# EAGLE schematic frc_operator_interface (EAGLE 6.5.0)
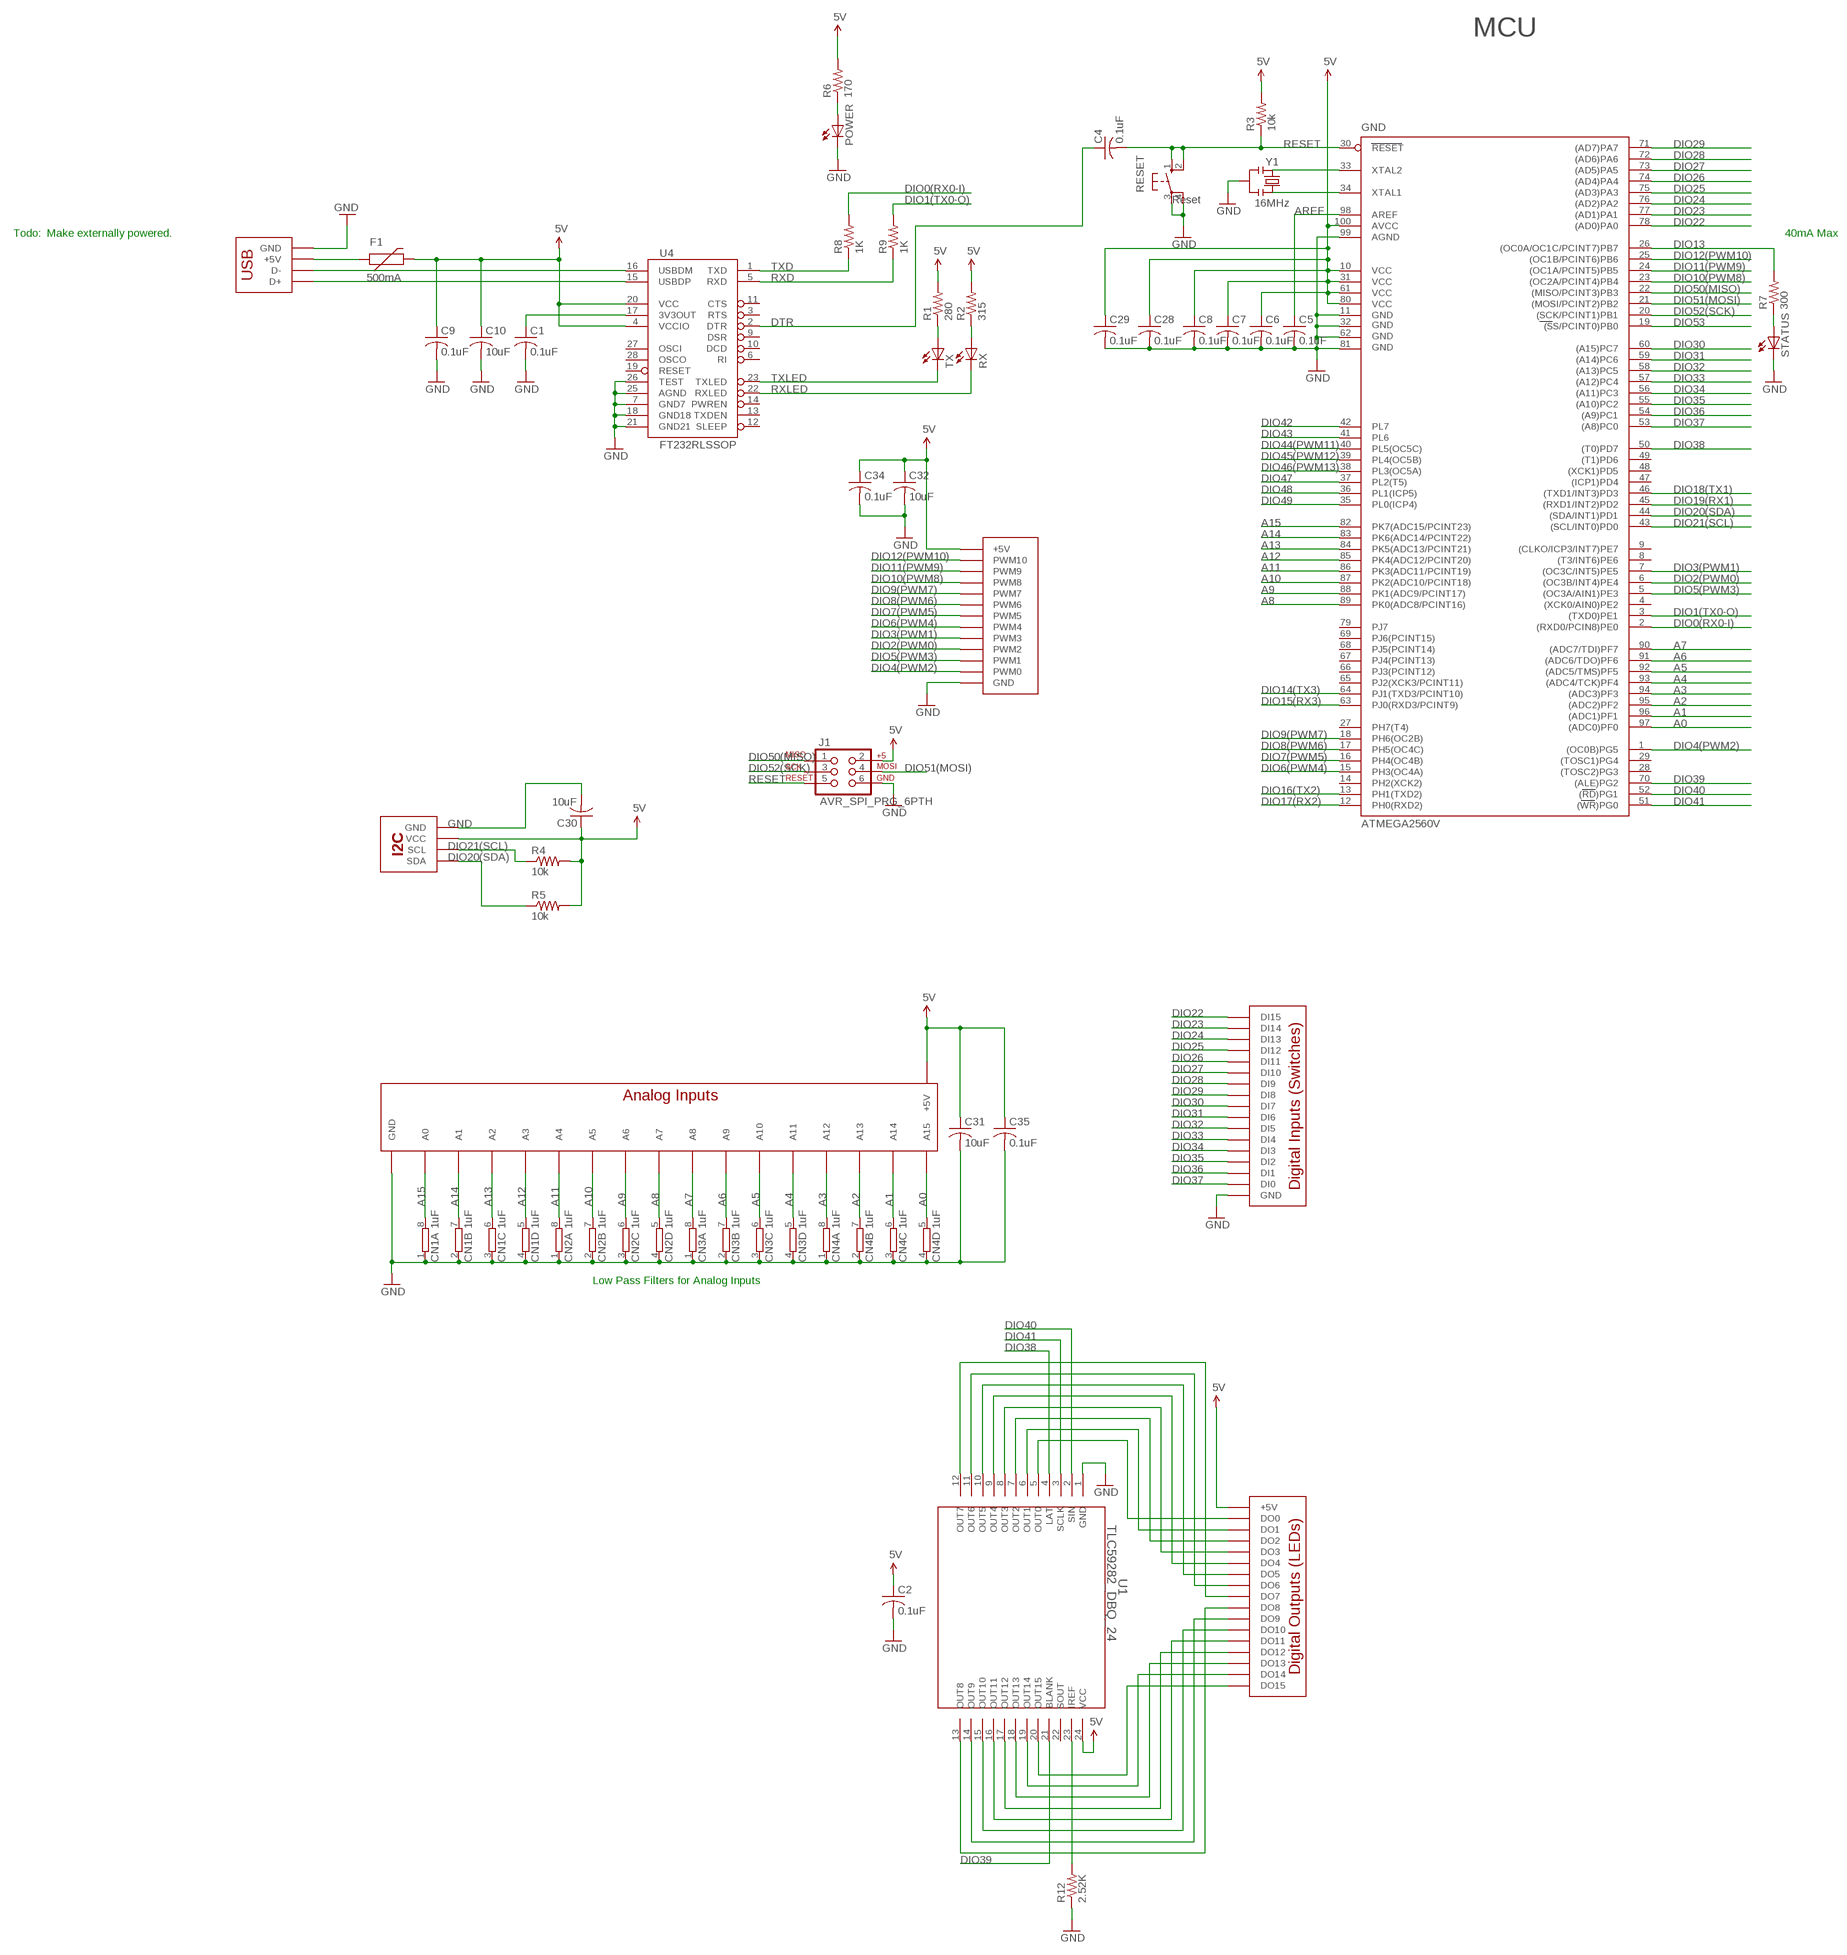
[diagram p0: schematic, sheet 1]

## Parts
C1  0.1uF  C-USC1206  [C1206]
C2  0.1uF  C-USC1206  [C1206]
C4  0.1uF  C-USC1206  [C1206]
C5  0.1uF  C-USC1206  [C1206]
C6  0.1uF  C-USC1206  [C1206]
C7  0.1uF  C-USC1206  [C1206]
C8  0.1uF  C-USC1206  [C1206]
C9  0.1uF  C-USC1206  [C1206]
C10  10uF  C-USC1206  [C1206]
C28  0.1uF  C-USC1206  [C1206]
C29  0.1uF  C-USC1206  [C1206]
C30  10uF  C-USC1206  [C1206]
C31  10uF  C-USC1206  [C1206]
C32  10uF  C-USC1206  [C1206]
C34  0.1uF  C-USC1206  [C1206]
C35  0.1uF  C-USC1206  [C1206]
CN1  1uF  4R-NEXB38V  [EXB38V]
CN2  1uF  4R-NEXB38V  [EXB38V]
CN3  1uF  4R-NEXB38V  [EXB38V]
CN4  1uF  4R-NEXB38V  [EXB38V]
F1  500mA  PTCSMD  [PTC-1206]
GND  ATMEGA2560AU  [TQFP100]
J1  AVR_SPI_PRG_6PTH  [2X3]
POWER  LED3MM  [LED3MM]
R1  280  R-US_M1206  [M1206]
R2  315  R-US_M1206  [M1206]
R3  10k  R-US_M1206  [M1206]
R4  10k  R-US_M1206  [M1206]
R5  10k  R-US_M1206  [M1206]
R6  170  R-US_M1206  [M1206]
R7  300  R-US_M1206  [M1206]
R8  1K  R-US_M1206  [M1206]
R9  1K  R-US_M1206  [M1206]
R12  2.52K  R-US_M1206  [M1206]
RESET  10-XX  [B3F-10XX]
RX  LED3MM  [LED3MM]
STATUS  LED3MM  [LED3MM]
TX  LED3MM  [LED3MM]
U1  TLC59282_DBQ_24  [DBQ24]
U4  FT232RLSSOP  [SSOP28DB]
U$2  DIGITALIN  [DIGITALIN]
U$10  PWMHEADER  [PWMHEADER]
U$11  DIGITALOUTPUTS  [DIGITALOUT]
U$12  ANALOGHEADER  [ANALOGHEADER]
U$14  UE27BC54130-USB  [UE27BC54130-USB]
U$15  I2CHEADER  [I2CHEADER]
Y1  RESONATORSMD  [RESONATOR-SMD]

## Nets
5V [power]: C2.1 C6.1 C7.1 C8.1 C9.1 C10.1 C28.1 C29.1 C30.1 C31.1 C32.1 C34.1 C35.1 F1.2 GND.10(VCC) GND.31(VCC1) GND.61(VCC2) GND.80(VCC3) GND.100(AVCC) J1.2 R1.2 R2.2 R3.2 R4.2 R5.2 R6.2 U1.24(VCC) U4.4(VCCIO) U4.20(VCC) U$10.+5V@3(+5V) U$10.+5V@4(+5V) U$10.+5V@5(+5V) U$10.+5V@6(+5V) U$10.+5V@7(+5V) U$10.+5V@8(+5V) U$10.+5V@9(+5V) U$10.+5V@10(+5V) U$10.+5V@11(+5V) U$10.+5V@12(+5V) U$10.+5V@13(+5V) U$11.+5V@0(+5V) U$11.+5V@1(+5V) U$11.+5V@2(+5V) U$11.+5V@3(+5V) U$11.+5V@4(+5V) U$11.+5V@5(+5V) U$11.+5V@6(+5V) U$11.+5V@7(+5V) U$11.+5V@8(+5V) U$11.+5V@9(+5V) U$11.+5V@10(+5V) U$11.+5V@11(+5V) U$11.+5V@12(+5V) U$11.+5V@13(+5V) U$11.+5V@14(+5V) U$11.+5V@15(+5V) U$12.+5V@0(+5V) U$12.+5V@1(+5V) U$12.+5V@2(+5V) U$12.+5V@3(+5V) U$12.+5V@4(+5V) U$12.+5V@5(+5V) U$12.+5V@6(+5V) U$12.+5V@7(+5V) U$12.+5V@8(+5V) U$12.+5V@9(+5V) U$12.+5V@10(+5V) U$12.+5V@11(+5V) U$12.+5V@12(+5V) U$12.+5V@13(+5V) U$12.+5V@14(+5V) U$12.+5V@15(+5V) U$15.VCC@0(VCC) U$15.VCC@1(VCC) U$15.VCC@2(VCC) U$15.VCC@3(VCC)
A0: CN4.5 GND.97((ADC0)PF0) U$12.15(A15)
A1: CN4.6 GND.96((ADC1)PF1) U$12.14(A14)
A2: CN4.7 GND.95((ADC2)PF2) U$12.13(A13)
A3: CN4.8 GND.94((ADC3)PF3) U$12.12(A12)
A4: CN3.5 GND.93((ADC4/TCK)PF4) U$12.11(A11)
A5: CN3.6 GND.92((ADC5/TMS)PF5) U$12.10(A10)
A6: CN3.7 GND.91((ADC6/TDO)PF6) U$12.9(A9)
A7: CN3.8 GND.90((ADC7/TDI)PF7) U$12.8(A8)
A8: CN2.5 GND.89(PK0(ADC8/PCINT16)) U$12.7(A7)
A9: CN2.6 GND.88(PK1(ADC9/PCINT17)) U$12.6(A6)
A10: CN2.7 GND.87(PK2(ADC10/PCINT18)) U$12.5(A5)
A11: CN2.8 GND.86(PK3(ADC11/PCINT19)) U$12.4(A4)
A12: CN1.5 GND.85(PK4(ADC12/PCINT20)) U$12.3(A3)
A13: CN1.6 GND.84(PK5(ADC13/PCINT21)) U$12.2(A2)
A14: CN1.7 GND.83(PK6(ADC14/PCINT22)) U$12.1(A1)
A15: CN1.8 GND.82(PK7(ADC15/PCINT23)) U$12.0(A0)
AREF: C5.1 GND.98(AREF)
DIO0(RX0-I): GND.2((RXD0/PCIN8)PE0) R8.2
DIO1(TX0-O): GND.3((TXD0)PE1) R9.2
DIO2(PWM0): GND.6((OC3B/INT4)PE4) U$10.2(PWM2)
DIO3(PWM1): GND.7((OC3C/INT5)PE5) U$10.3(PWM3)
DIO4(PWM2): GND.1((OC0B)PG5) U$10.0(PWM0)
DIO5(PWM3): GND.5((OC3A/AIN1)PE3) U$10.1(PWM1)
DIO6(PWM4): GND.15(PH3(OC4A)) U$10.4(PWM4)
DIO7(PWM5): GND.16(PH4(OC4B)) U$10.5(PWM5)
DIO8(PWM6): GND.17(PH5(OC4C)) U$10.6(PWM6)
DIO9(PWM7): GND.18(PH6(OC2B)) U$10.7(PWM7)
DIO10(PWM8): GND.23((OC2A/PCINT4)PB4) U$10.8(PWM8)
DIO11(PWM9): GND.24((OC1A/PCINT5)PB5) U$10.9(PWM9)
DIO12(PWM10): GND.25((OC1B/PCINT6)PB6) U$10.10(PWM10)
DIO13: GND.26((OC0A/OC1C/PCINT7)PB7) R7.2
DIO14(TX3): GND.64(PJ1(TXD3/PCINT10))
DIO15(RX3): GND.63(PJ0(RXD3/PCINT9))
DIO16(TX2): GND.13(PH1(TXD2))
DIO17(RX2): GND.12(PH0(RXD2))
DIO18(TX1): GND.46((TXD1/INT3)PD3)
DIO19(RX1): GND.45((RXD1/INT2)PD2)
DIO20(SDA): GND.44((SDA/INT1)PD1) R5.1 U$15.SDA@0(SDA) U$15.SDA@1(SDA) U$15.SDA@2(SDA) U$15.SDA@3(SDA)
DIO21(SCL): GND.43((SCL/INT0)PD0) R4.1 U$15.SCL@0(SCL) U$15.SCL@1(SCL) U$15.SCL@2(SCL) U$15.SCL@3(SCL)
DIO22: GND.78((AD0)PA0) U$2.DI15
DIO23: GND.77((AD1)PA1) U$2.DI14
DIO24: GND.76((AD2)PA2) U$2.DI13
DIO25: GND.75((AD3)PA3) U$2.DI12
DIO26: GND.74((AD4)PA4) U$2.DI11
DIO27: GND.73((AD5)PA5) U$2.DI10
DIO28: GND.72((AD6)PA6) U$2.DI9
DIO29: GND.71((AD7)PA7) U$2.DI8
DIO30: GND.60((A15)PC7) U$2.DI7
DIO31: GND.59((A14)PC6) U$2.DI6
DIO32: GND.58((A13)PC5) U$2.DI5
DIO33: GND.57((A12)PC4) U$2.DI4
DIO34: GND.56((A11)PC3) U$2.DI3
DIO35: GND.55((A10)PC2) U$2.DI2
DIO36: GND.54((A9)PC1) U$2.DI1
DIO37: GND.53((A8)PC0) U$2.DI0
DIO38: GND.50((T0)PD7) U1.4(LAT)
DIO39: GND.70((ALE)PG2) U1.21(BLANK)
DIO40: GND.52((RD)PG1) U1.2(SIN)
DIO41: GND.51((WR)PG0) U1.3(SCLK)
DIO42: GND.42(PL7)
DIO43: GND.41(PL6)
DIO44(PWM11): GND.40(PL5(OC5C))
DIO45(PWM12): GND.39(PL4(OC5B))
DIO46(PWM13): GND.38(PL3(OC5A))
DIO47: GND.37(PL2(T5))
DIO48: GND.36(PL1(ICP5))
DIO49: GND.35(PL0(ICP4))
DIO50(MISO): GND.22((MISO/PCINT3)PB3) J1.1
DIO51(MOSI): GND.21((MOSI/PCINT2)PB2) J1.4
DIO52(SCK): GND.20((SCK/PCINT1)PB1) J1.3
DIO53: GND.19((SS/PCINT0)PB0)
DTR: C4.1 U4.2(DTR)
GND [power]: C1.2 C2.2 C5.2 C6.2 C7.2 C8.2 C9.2 C10.2 C28.2 C29.2 C30.2 C31.2 C32.2 C34.2 C35.2 CN1.1 CN1.2 CN1.3 CN1.4 CN2.1 CN2.2 CN2.3 CN2.4 CN3.1 CN3.2 CN3.3 CN3.4 CN4.1 CN4.2 CN4.3 CN4.4 GND.11(GND) GND.32(GND1) GND.62(GND2) GND.81(GND3) GND.99(AGND) J1.6 POWER.K(C) R12.1 RESET.3(P) RESET.4(P1) STATUS.K(C) U1.1(GND) U4.7(GND7) U4.18(GND18) U4.21(GND21) U4.25(AGND) U4.26(TEST) U$2.GND@0(GND) U$2.GND@1(GND) U$2.GND@2(GND) U$2.GND@3(GND) U$2.GND@4(GND) U$2.GND@5(GND) U$2.GND@6(GND) U$2.GND@7(GND) U$2.GND@8(GND) U$2.GND@9(GND) U$2.GND@10(GND) U$2.GND@11(GND) U$2.GND@12(GND) U$2.GND@13(GND) U$2.GND@14(GND) U$2.GND@15(GND) U$10.GND@3(GND) U$10.GND@4(GND) U$10.GND@5(GND) U$10.GND@6(GND) U$10.GND@7(GND) U$10.GND@8(GND) U$10.GND@9(GND) U$10.GND@10(GND) U$10.GND@11(GND) U$10.GND@12(GND) U$10.GND@13(GND) U$12.GND@0(GND) U$12.GND@1(GND) U$12.GND@2(GND) U$12.GND@3(GND) U$12.GND@4(GND) U$12.GND@5(GND) U$12.GND@6(GND) U$12.GND@7(GND) U$12.GND@8(GND) U$12.GND@9(GND) U$12.GND@10(GND) U$12.GND@11(GND) U$12.GND@12(GND) U$12.GND@13(GND) U$12.GND@14(GND) U$12.GND@15(GND) U$14.GND@0(GND) U$14.GND@1(GND) U$14.GND@2(GND) U$15.GND@0(GND) U$15.GND@1(GND) U$15.GND@2(GND) U$15.GND@3(GND) Y1.2
N$1: R1.1 TX.A
N$2: POWER.A R6.1
N$3: R7.1 STATUS.A
N$4: F1.1 U$14.+5V
N$5: R2.1 RX.A
N$21: C1.1 U4.17(3V3OUT)
N$25 [power]: U1.6(OUT1) U$11.DO1
N$26 [power]: U1.7(OUT2) U$11.DO2
N$27 [power]: U1.5(OUT0) U$11.DO0
N$28 [power]: U1.8(OUT3) U$11.DO3
N$29 [power]: U1.9(OUT4) U$11.DO4
N$30 [power]: U1.10(OUT5) U$11.DO5
N$31 [power]: U1.11(OUT6) U$11.DO6
N$32 [power]: U1.12(OUT7) U$11.DO7
N$33 [power]: U1.20(OUT15) U$11.DO15
N$34 [power]: U1.19(OUT14) U$11.DO14
N$35 [power]: U1.18(OUT13) U$11.DO13
N$36 [power]: U1.17(OUT12) U$11.DO12
N$37 [power]: U1.16(OUT11) U$11.DO11
N$38 [power]: U1.15(OUT10) U$11.DO10
N$39 [power]: U1.14(OUT9) U$11.DO9
N$40 [power]: U1.13(OUT8) U$11.DO8
N$41 [power]: R12.2 U1.23(IREF)
N$73: GND.33(XTAL2) Y1.1
N$74: GND.34(XTAL1) Y1.3
RESET: C4.2 GND.30(RESET) J1.5 R3.1 RESET.1(S) RESET.2(S1)
RXD: R9.1 U4.5(RXD)
RXLED: RX.K(C) U4.22(RXLED)
TXD: R8.1 U4.1(TXD)
TXLED: TX.K(C) U4.23(TXLED)
USB_D_N: U4.16(USBDM) U$14.-DATA(D-)
USB_D_P: U4.15(USBDP) U$14.+DATA(D+)
Unconnected: GND.4((XCK0/AIN0)PE2) GND.8((T3/INT6)PE6) GND.9((CLKO/ICP3/INT7)PE7) GND.14(PH2(XCK2)) GND.27(PH7(T4)) GND.28((TOSC2)PG3) GND.29((TOSC1)PG4) GND.47((ICP1)PD4) GND.48((XCK1)PD5) GND.49((T1)PD6) GND.65(PJ2(XCK3/PCINT11)) GND.66(PJ3(PCINT12)) GND.67(PJ4(PCINT13)) GND.68(PJ5(PCINT14)) GND.69(PJ6(PCINT15)) GND.79(PJ7) U1.22(SOUT) U4.3(RTS) U4.6(RI) U4.9(DSR) U4.10(DCD) U4.11(CTS) U4.12(SLEEP) U4.13(TXDEN) U4.14(PWREN) U4.19(RESET) U4.27(OSCI) U4.28(OSCO)

## Notes on the sheet
- MCU
- Reset
- 16MHz
- Todo: | Make externally powered. | 40mA Max
- ATMEGA2560V
- Low Pass Filters for Analog Inputs

## Library data of the parts
C1 C2 C4-C10 C28-C32 C34 C35 = rcl:C-US: CAPACITOR, American symbol
CN1-CN4 = resistor-dil:4R-N: Array Chip Resistor Source: RS Component / Phycomp; OC_FARNELL: unknown; OC_NEWARK: unknown
F1 = SparkFun-PowerIC:PTC: Resettable Fuse PTC Resettable Fuse. Spark Fun Electronics SKU : COM-08357; PROD_ID: RES-11150
GND = SparkFun:ATMEGA2560: MICROCONTROLLER 64/128/256 Kbytes FLASH 4 Kbytes EEPROM 8 Kbytes SRAM 86 General Purpose I/O pins 12-channels16-bit PWM 4 x Serial USARTs 16-channels 10-bit A/D
J1 = SparkFun:AVR_SPI_PRG_6: AVR ISP 6 Pin This is the reduced ISP connector for AVR programming. Common on Arduino. This footprint will take up less PCB space and can be used with a 10-pin to 6-pin adapter such as SKU: BOB-08508
POWER RX STATUS TX = SparkFun-LED:LED: LEDs Standard schematic elements and footprints for 5mm, 3mm, 1206, and 0603 sized LEDs. 5mm - Spark Fun Electronics SKU : COM-00529 (and others)
R1-R9 R12 = rcl:R-US_: RESISTOR, American symbol
RESET = switch-omron:10-XX: OMRON SWITCH; MPN: B3F-1000; OC_FARNELL: 176432; OC_NEWARK: 36M3542
U1 = teamFusion:TLC59282_DBQ_24; DATASHEETURL: http://www.ti.com/lit/gpn/TLC59282; DESCRIPTION: 16-Channel Constant Current LED Driver with 4-Channel Grouped Delay; FAMILY_NAME: LED DRIVER; GENERIC_PART_NUMBER: TLC59282; INDUSTRY_STD_PKG_TYPE: SSOP/QSOP; MANUFACTURER: Texas Instruments; MANUFACTURER_PART_NUMBER: tlc59282_dbq_24; PACKAGE_DESIGNATOR: DBQ; PIN_COUNT: 24; VENDOR: Texas Instruments
U4 = SparkFun:FT232RL: USB UART FT232RL 4th Generation USB UART (USB <-> Serial) Controller. Spark Fun Electronics SKU : COM-00650
U$2 = teamFusion:DIGITALIN
U$10 = teamFusion:PWMHEADER
U$11 = teamFusion:DIGITALOUTPUTS
U$12 = teamFusion:ANALOGHEADER
U$14 = teamFusion:UE27BC54130-USB
U$15 = teamFusion:I2CHEADER
Y1 = SparkFun:RESONATOR: Resonator Small SMD resonator. This is the itty bitty 10/20MHz resonators with built in caps. CSTCE10M0G55 and CSTCE20M0V53. Footprint has been reviewed closely but hasn't been tested yet.

## Net classes
0 default: width 0.203 mm
1 power: width 0.254 mm